# Altium schematic sheet Schematic_KeyScreen.SchDoc
size 330 x 152 mm
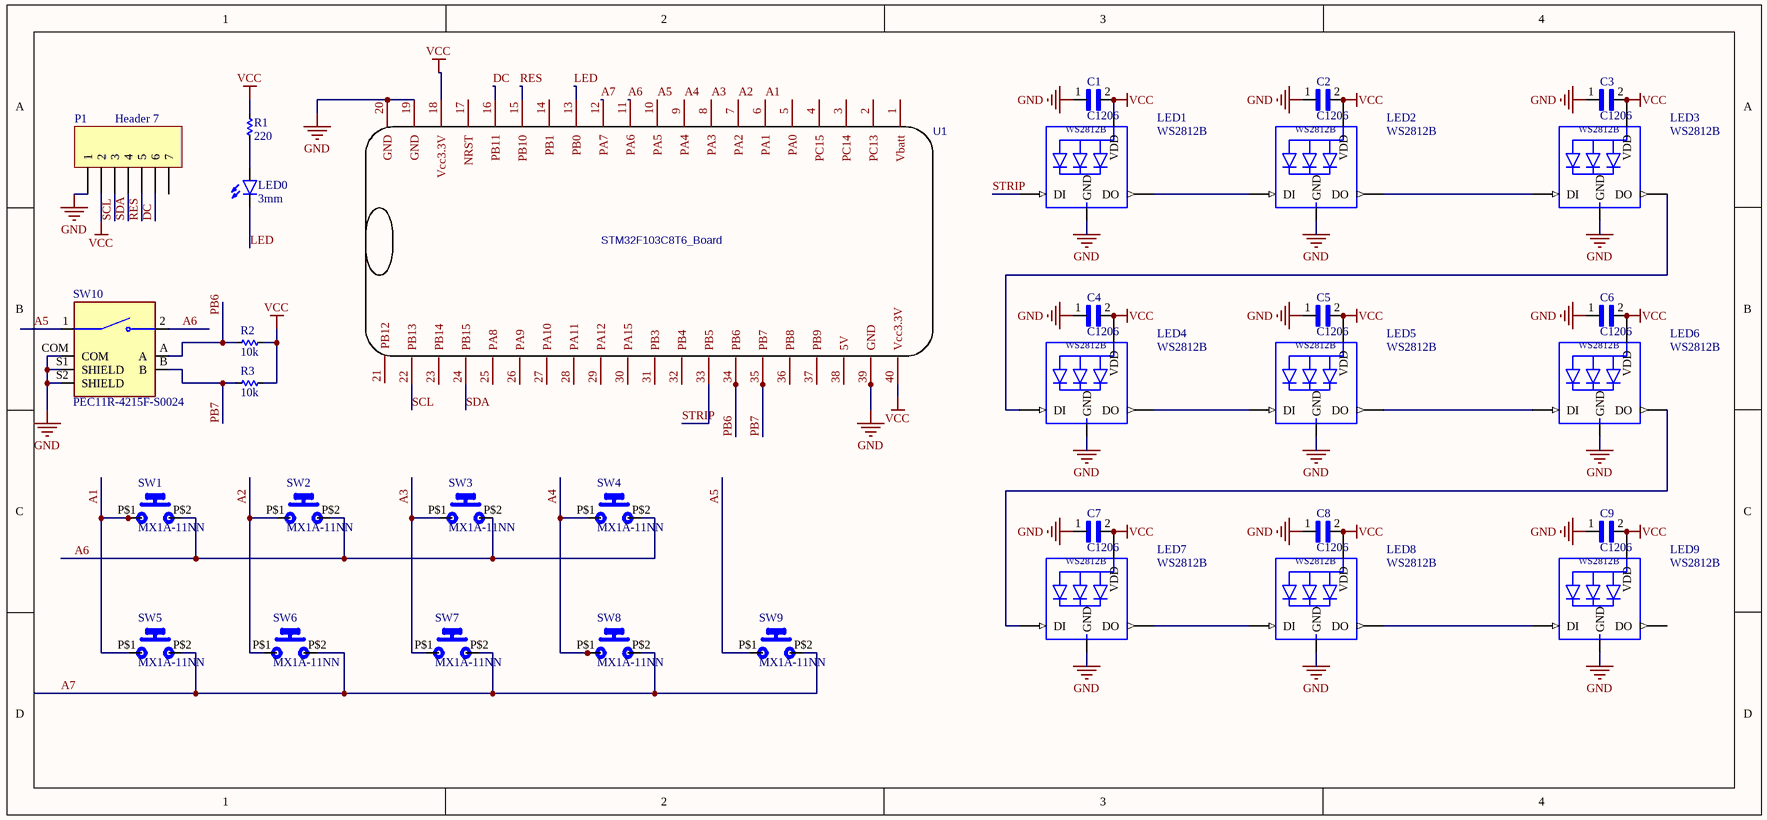
[diagram p0: Schematic_KeyScreen.SchDoc]

## Parts
C1  C1206  [CAPC3216X110N]
C2  C1206  [CAPC3216X110N]
C3  C1206  [CAPC3216X110N]
C4  C1206  [CAPC3216X110N]
C5  C1206  [CAPC3216X110N]
C6  C1206  [CAPC3216X110N]
C7  C1206  [3.2X1.6X1.1]
C8  C1206  [3.2X1.6X1.1]
C9  C1206  [CAPC3216X110N]
LED0  3mm  [LED3MM]
LED1  WS2812B  [WS2812B]
LED2  WS2812B  [WS2812B]
LED3  WS2812B  [WS2812B]
LED4  WS2812B  [WS2812B]
LED5  WS2812B  [WS2812B]
LED6  WS2812B  [WS2812B]
LED7  WS2812B  [WS2812B]
LED8  WS2812B  [WS2812B]
LED9  WS2812B  [WS2812B]
P1  Header 7  [HDR1X7]
R1  220  [RESC3116X65N]
R2  10k  [RESC3116X65N]
R3  10k  [RESC3116X65N]
SW1  MX1A-11NN  [CHERRY_MX1A-11NN_SWITCH]
SW2  MX1A-11NN  [CHERRY_MX1A-11NN_SWITCH]
SW3  MX1A-11NN  [CHERRY_MX1A-11NN_SWITCH]
SW4  MX1A-11NN  [CHERRY_MX1A-11NN_SWITCH]
SW5  MX1A-11NN  [CHERRY_MX1A-11NN_SWITCH]
SW6  MX1A-11NN  [CHERRY_MX1A-11NN_SWITCH]
SW7  MX1A-11NN  [CHERRY_MX1A-11NN_SWITCH]
SW8  MX1A-11NN  [CHERRY_MX1A-11NN_SWITCH]
SW9  MX1A-11NN  [CHERRY_MX1A-11NN_SWITCH]
SW10  PEC11R-4215F-S0024  [XDCR_PEC11R-4215F-S0024]
U1  STM32F103C8T6_Board  [PCBComponent_1]

## Nets
GND: C1.1 C2.1 C3.1 C4.1 C5.1 C6.1 C7.1 C8.1 C9.1 LED1.3-GND(GND) LED2.3-GND(GND) LED3.3-GND(GND) LED4.3-GND(GND) LED5.3-GND(GND) LED6.3-GND(GND) LED7.3-GND(GND) LED8.3-GND(GND) LED9.3-GND(GND) P1.1 SW10.COM SW10.S1(SHIELD) SW10.S2(SHIELD) U1.19(GND) U1.20(GND) U1.39(GND)
VCC: C1.2 C2.2 C3.2 C4.2 C5.2 C6.2 C7.2 C8.2 C9.2 LED1.1-VDD(VDD) LED2.1-VDD(VDD) LED3.1-VDD(VDD) LED4.1-VDD(VDD) LED5.1-VDD(VDD) LED6.1-VDD(VDD) LED7.1-VDD(VDD) LED8.1-VDD(VDD) LED9.1-VDD(VDD) P1.2 R1.1 R2.1 R3.1 U1.18(Vcc3.3V) U1.40(Vcc3.3V)
A1: SW1.P$1(P) SW5.P$1(P) U1.6(PA1)
A2: SW2.P$1(P) SW6.P$1(P) U1.7(PA2)
A3: SW3.P$1(P) SW7.P$1(P) U1.8(PA3)
A4: SW4.P$1(P) SW8.P$1(P) U1.9(PA4)
A5: SW9.P$1(P) SW10.1 U1.10(PA5)
A6: SW1.P$2(S) SW2.P$2(S) SW3.P$2(S) SW4.P$2(S) SW10.2 U1.11(PA6)
A7: SW5.P$2(S) SW6.P$2(S) SW7.P$2(S) SW8.P$2(S) SW9.P$2(S) U1.12(PA7)
DC: P1.6 U1.16(PB11)
LED: LED0.K(C) U1.13(PB0)
PB6: R2.2 SW10.A U1.34(PB6)
PB7: R3.2 SW10.B U1.35(PB7)
RES: P1.5 U1.15(PB10)
SCL: P1.3 U1.22(PB13)
SDA: P1.4 U1.24(PB15)
STRIP: LED1.4-DIN(DI) U1.33(PB5)
NetLED0_A: LED0.A R1.2
NetLED1_2-DOUT: LED1.2-DOUT(DO) LED2.4-DIN(DI)
NetLED2_2-DOUT: LED2.2-DOUT(DO) LED3.4-DIN(DI)
NetLED3_2-DOUT: LED3.2-DOUT(DO) LED4.4-DIN(DI)
NetLED4_2-DOUT: LED4.2-DOUT(DO) LED5.4-DIN(DI)
NetLED5_2-DOUT: LED5.2-DOUT(DO) LED6.4-DIN(DI)
NetLED6_2-DOUT: LED6.2-DOUT(DO) LED7.4-DIN(DI)
NetLED7_2-DOUT: LED7.2-DOUT(DO) LED8.4-DIN(DI)
NetLED8_2-DOUT: LED8.2-DOUT(DO) LED9.4-DIN(DI)

Not connected (* = marked no-connect by the designer): LED9 2-DOUT(DO); P1 7; U1 1(Vbatt) 2(PC13) 3(PC14) 4(PC15) 5(PA0) 14(PB1) 17(NRST) 21(PB12) 23(PB14) 25(PA8) 26(PA9) 27(PA10) 28(PA11) 29(PA12) 30(PA15) 31(PB3) 32(PB4) 36(PB8) 37(PB9) 38(5V)

## Notes on the sheet
- Title
- Size:
- Date:
- A3
- Number:
- Time:
- Revision:
- Sheet
- of
- File:

## Library data of the parts
C1-C9 = C1206C105K5RACTU: 1ÂµF Â±10% 50V Ceramic Capacitor X7R 1206 _3216 Metric_; MF: KEMET; Value: *; MP: C1206C105K5RACTU; Package: 3216 KEMET; SnapEDA_Link: https://www.snapeda.com/parts/C1206C105K5RACTU/KEMET/view-part/357507/?ref=snap; Digi-Key_Part_Number: 399-8147-1-ND; Digi-Key_Purchase_URL: https://www.digikey.com/product-detail/en/kemet/C1206C105K5RACTU/399-8147-1-ND/3471870?utm_source=snapeda&utm_medium=aggregator&utm_campaign=symbol
LED0 = TLLG4400: Green 569nm LED Indication - Discrete 1.9V Radial; MF: Vishay Semiconductors; MP: TLLG4400; SnapEDA_Link: https://www.snapeda.com/parts/TLLG4400/Vishay/view-part/?ref=snap; Availability: In Stock; Package: None; Check_prices: https://www.snapeda.com/parts/TLLG4400/Vishay/view-part/?ref=eda; Value: *; Purchase-URL: https://pricing.snapeda.com/search/part/TLLG4400/?ref=eda; Price: None
LED1-LED9 = WS2812B: Raspberry Pi HAT _40 pin_ Wheeled Robotics Kit; MF: SparkFun Electronics; Availability: Unavailable; SnapEDA_Link: https://www.snapeda.com/parts/WS2812B/Worldsemi/view-part/1038297/?ref=snap; MP: WS2812B; Price: None; Value: *; Package: None
P1 = Header 7: Header, 7-Pin; LatestRevisionDate: 17-Jul-2002; LatestRevisionNote: Re-released for DXP Platform.; Publisher: Altium Limited
R1-R3 = Res-SMD: Resistor; Manufacturer: Generic Components; Class: Passive; Published: 08/06/2000; Publisher: Altium Hobart Technology Centre
SW1-SW9 = MX1A-11NN: Pushbutton Switch SPST-NO Keyswitch Panel Mount, Front; MF: Cherry; Check_prices: https://www.snapeda.com/parts/MX1A-11NN/Cherry/view-part/?ref=eda; Price: None; Availability: In Stock; SnapEDA_Link: https://www.snapeda.com/parts/MX1A-11NN/Cherry/view-part/?ref=snap; Value: *; Package: None; MP: MX1A-11NN; Purchase-URL: https://pricing.snapeda.com/search/part/MX1A-11NN/?ref=eda
SW10 = PEC11R-4215F-S0024: Incremental Encoder, 12 Mm, Contact Rating 10 Ma - 5 Vdc; Price: None; Availability: Unavailable; MP: PEC11R-4215F-S0024; Value: *; Package: None
U1 = STM32F103C8T6_Blue pill: Manufacturer Part: STM32Duino; Contributor: Johan_a; spicePre: U; spiceSymbolName: STM32F103C8T6_Development_Board copy